# EAGLE design ArduinoSIDInterface (EAGLE 6.4)
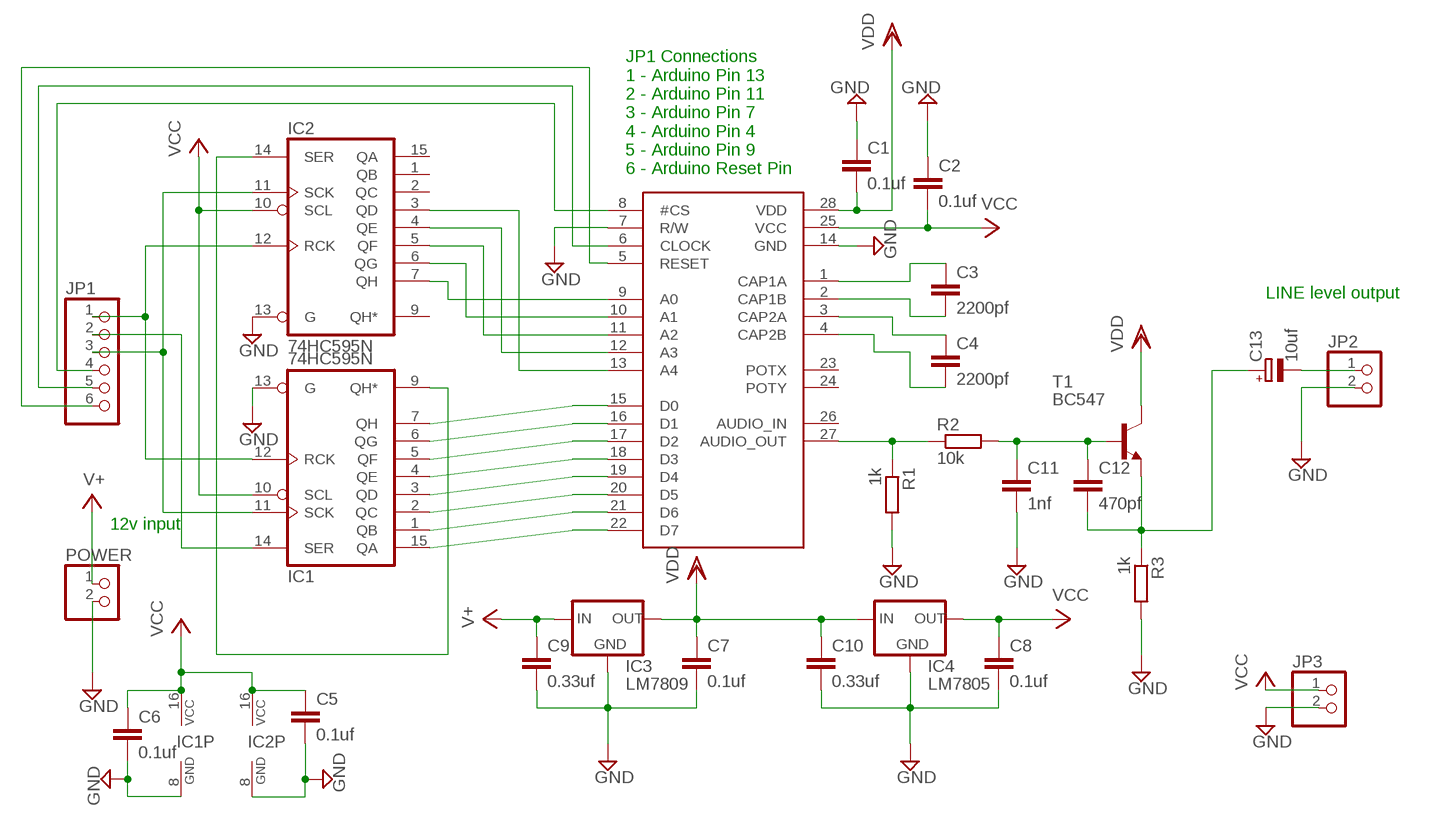
[diagram p0: schematic, sheet 1]

## Parts
C1  0.1uf  C-EU050-035X075  [C050-035X075]
C2  0.1uf  C-EU050-030X075  [C050-030X075]
C3  2200pf  C-EU075-042X103  [C075-042X103]
C4  2200pf  C-EU075-042X103  [C075-042X103]
C5  0.1uf  C-EU050-030X075  [C050-030X075]
C6  0.1uf  C-EU050-030X075  [C050-030X075]
C7  0.1uf  C10/4  [C10B4]
C8  0.1uf  C10/4  [C10B4]
C9  0.33uf  C15/5  [C15B5]
C10  0.33uf  C15/5  [C15B5]
C11  1nf  C-EU050-030X075  [C050-030X075]
C12  470pf  C-EU050-030X075  [C050-030X075]
C13  10uf  CPOL-EUE2-5  [E2-5]
IC1  74HC595N  [DIL16]
IC2  74HC595N  [DIL16]
IC3  LM7809  78XXS  [78XXS]
IC4  LM7805  78XXS  [78XXS]
JP1  PINHD-1X6  [1X06]
JP2  PINHD-1X2  [1X02]
JP3  PINHD-1X2  [1X02]
POWER  PINHD-1X2  [1X02]
R1  1k  R-EU_0204/7  [0204/7]
R2  10k  R-EU_0204/7  [0204/7]
R3  1k  R-EU_0204/7  [0204/7]
T1  BC547  [TO92]
U$1  6581  [DIL28-6]

## Nets
D0: IC1.7(QH) U$1.15(D0)
D1: IC1.6(QG) U$1.16(D1)
D2: IC1.5(QF) U$1.17(D2)
D3: IC1.4(QE) U$1.18(D3)
D4: IC1.3(QD) U$1.19(D4)
D5: IC1.2(QC) U$1.20(D5)
D6: IC1.1(QB) U$1.21(D6)
D7: IC1.15(QA) U$1.22(D7)
DATA: JP1.4 U$1.8(#CS)
GND: C1.1 C2.1 C5.2 C6.2 C7.2 C8.2 C9.2 C10.2 C11.2 IC1.8(GND) IC1.13(G) IC2.8(GND) IC2.13(G) IC3.GND IC4.GND JP2.2 JP3.2 POWER.2 R1.2 R3.2 U$1.7(R/W) U$1.14(GND)
N$1: IC1.9(QH*) IC2.14(SER)
N$2: C3.1 U$1.1(CAP1A)
N$3: IC2.7(QH) U$1.9(A0)
N$4: IC2.6(QG) U$1.10(A1)
N$5: IC2.5(QF) U$1.11(A2)
N$6: IC2.4(QE) U$1.12(A3)
N$7: IC2.3(QD) U$1.13(A4)
N$11: JP1.5 U$1.6(CLOCK)
N$12: JP1.6 U$1.5(RESET)
N$16: C3.2 U$1.2(CAP1B)
N$17: C4.1 U$1.3(CAP2A)
N$20: C4.2 U$1.4(CAP2B)
N$21: R1.1 R2.1 U$1.27(AUDIO_OUT)
N$22: C11.1 C12.1 R2.2 T1.2(B)
N$24: C12.2 C13.+ R3.1 T1.1(E)
N$26: C13.- JP2.1
RCK: IC1.12(RCK) IC2.12(RCK) JP1.1
SCK: IC1.11(SCK) IC2.11(SCK) JP1.3
SER: IC1.14(SER) JP1.2
V+: C9.1 IC3.IN POWER.1
VCC: C2.2 C5.1 C6.1 C8.1 IC1.10(SCL) IC1.16(VCC) IC2.10(SCL) IC2.16(VCC) IC4.OUT JP3.1 U$1.25(VCC)
VDD: C1.2 C7.1 C10.1 IC3.OUT IC4.IN T1.3(C) U$1.28(VDD)
Unconnected: IC2.1(QB) IC2.2(QC) IC2.9(QH*) IC2.15(QA) U$1.23(POTX) U$1.24(POTY) U$1.26(AUDIO_IN)

## Notes on the sheet
- JP1 Connections
  1 - Arduino Pin 13
  2 - Arduino Pin 11
  3 - Arduino Pin 7
  4 - Arduino Pin 4
  5 - Arduino Pin 9
  6 - Arduino Reset Pin
- LINE level output
- 12v input

## Library data of the parts
C1-C6 C11 C12 = rcl:C-EU: CAPACITOR, European symbol
C7-C10 = capacitor-wima:C: CAPACITOR naming: grid - package width
C13 = rcl:CPOL-EU: POLARIZED CAPACITOR, European symbol
IC1 IC2 = 74xx-eu:74*595: 8-bit SHIFT REGISTER, output latch
IC3 IC4 = v-reg:78XXS: VOLTAGE REGULATOR
JP1 = pinhead:PINHD-1X6: PIN HEADER
JP2 JP3 POWER = pinhead:PINHD-1X2: PIN HEADER
R1-R3 = resistor:R-EU_: RESISTOR, European symbol
T1 = transistor:BC547: NPN TRANSISTOR
U$1 = Mos6581_sid:6581: The Famous C64 Sound Chip - MOS6581

## Board
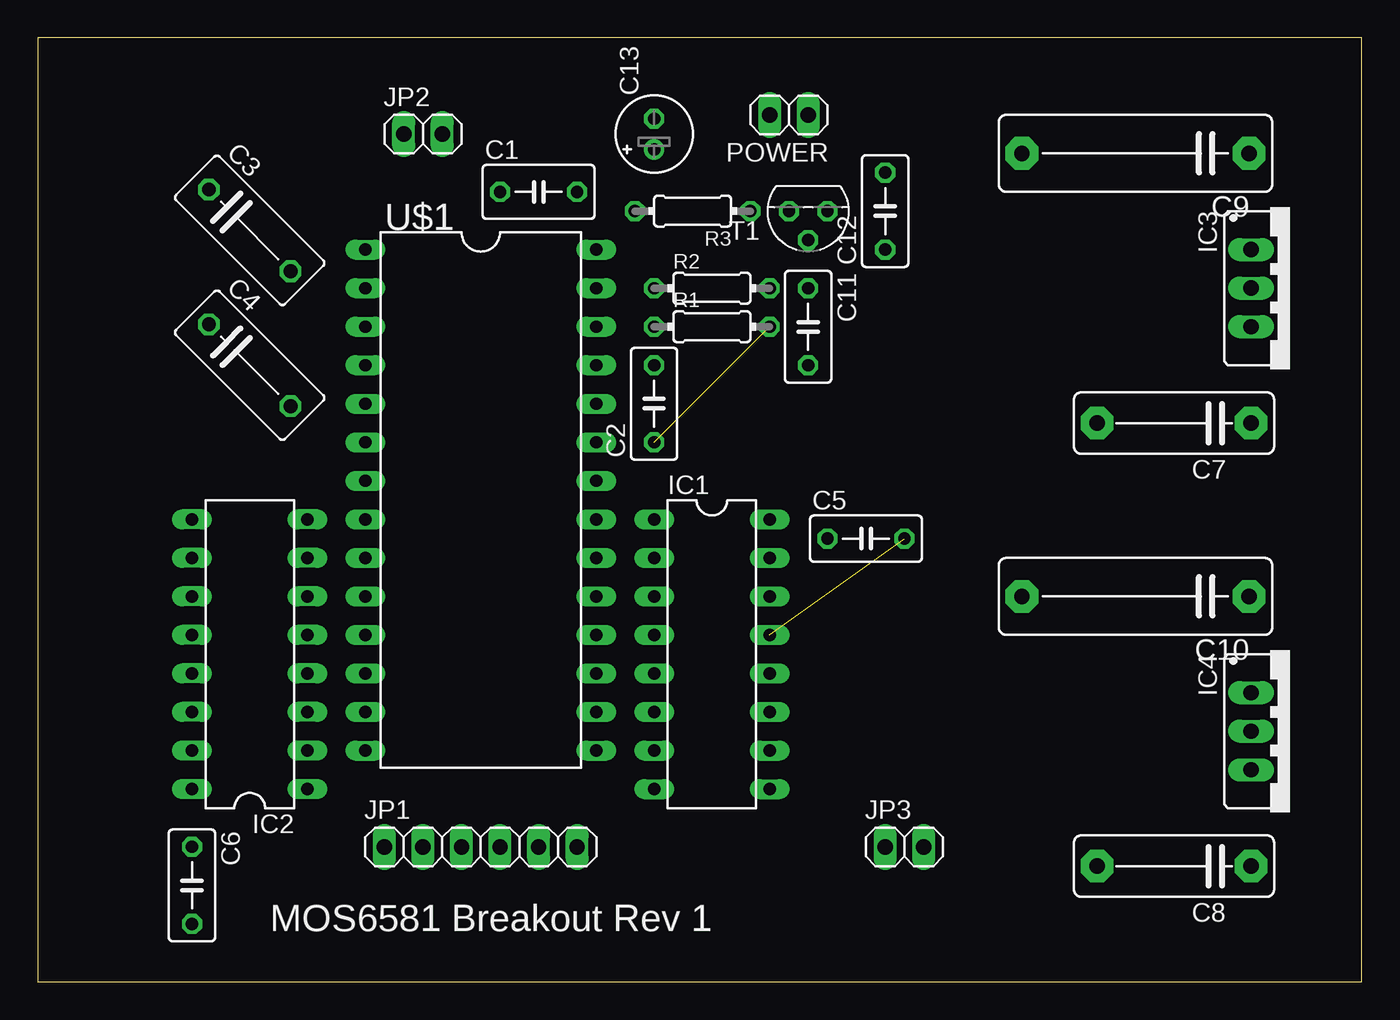
[diagram p1: board, top side]
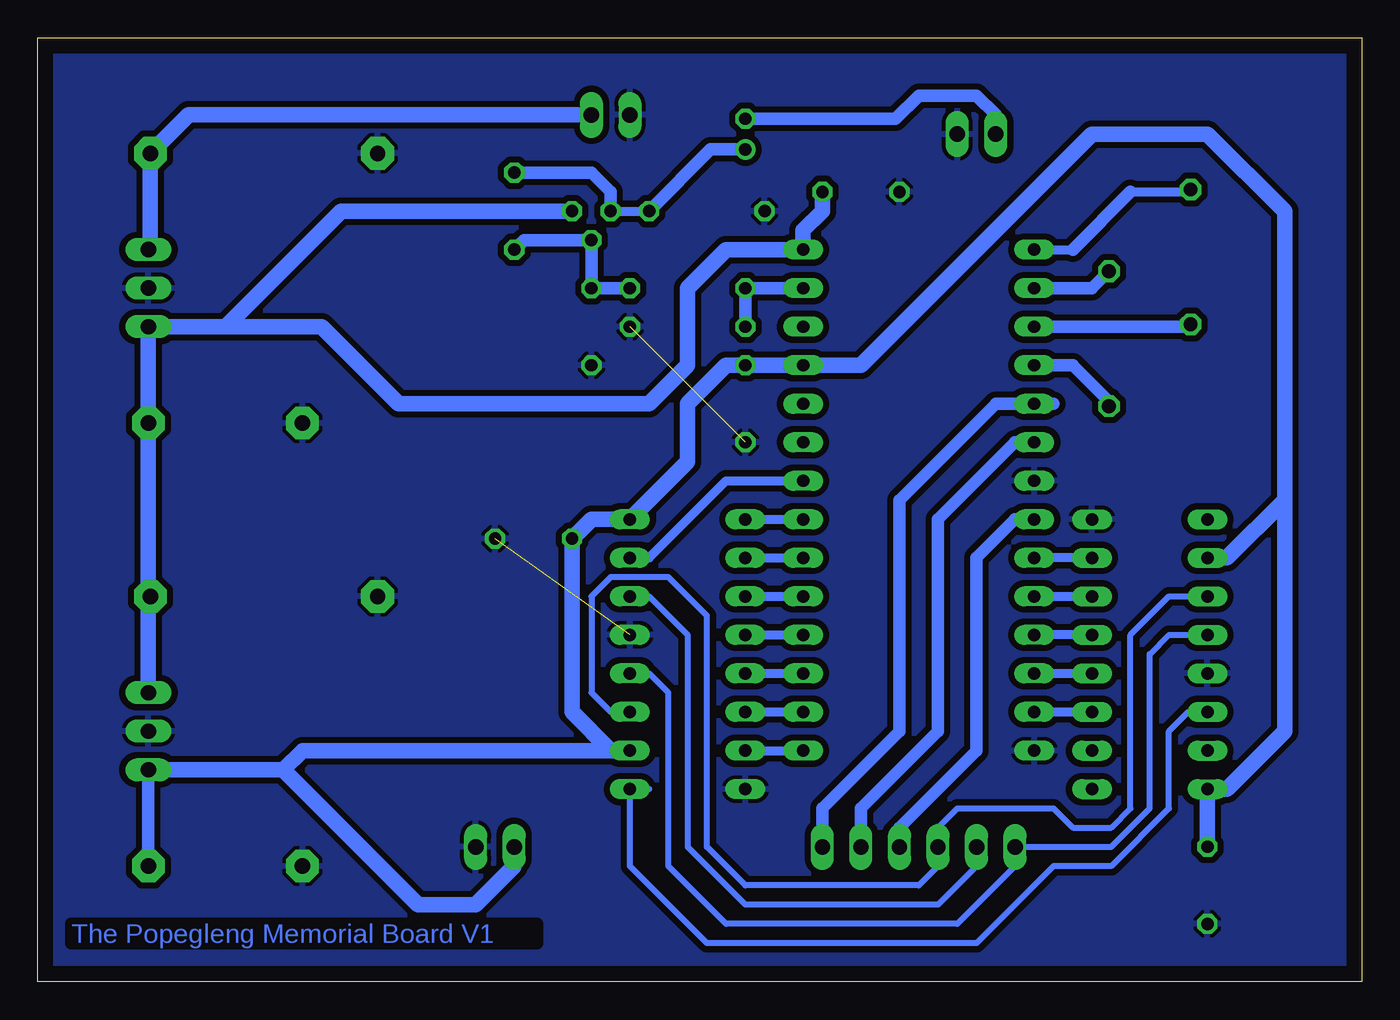
[diagram p2: board, bottom side, seen from below]

Size 87.3 x 62.22 mm. Coordinates in mm from the lower left corner, seen from the top.
Outline: 0,0 87.3,0 87.3,62.22 0,62.22 0,0
Copper layers (1*16): Top 0.035mm / dielectric 1.5mm / Bottom 0.035mm
Design rules "default": minimum track width 10mil, minimum drill 24mil, track to track 8mil, track to pad 8mil, pad to pad 8mil, via to via 8mil, smd to smd 8mil, copper to edge 40mil, drill to drill 8mil, minimum pad ring 10mil, minimum via ring 8mil, stop-mask expansion 4mil, vias tented up to drill 0mil, thermal gap 10mil

### Footprints (pad centres in the part's own frame; a part is rotated, then mirrored left to right if it is on the bottom)
C050-035X075 = drill 0.813 octagon: 1 -2.54,0; 2 2.54,0
C050-030X075 = drill 0.813 octagon: 1 -2.54,0; 2 2.54,0
C075-042X103 = drill 0.914 octagon: 1 -3.81,0; 2 3.81,0
C10B4 = drill 1.016 pad 2.159 octagon: 1 -5.08,0; 2 5.08,0
C15B5 = drill 1.016 pad 2.159 octagon: 1 -7.493,0; 2 7.493,0
E2-5 = drill 0.813 pad 1.27: + -1.016,0 | drill 0.813 pad 1.27 octagon: - 1.016,0
DIL16 = drill 0.813 long: 1 -8.89,-3.81; 2 -6.35,-3.81; 3 -3.81,-3.81; 4 -1.27,-3.81; 5 1.27,-3.81; 6 3.81,-3.81; 7 6.35,-3.81; 8 8.89,-3.81; 9 8.89,3.81; 10 6.35,3.81; 11 3.81,3.81; 12 1.27,3.81; 13 -1.27,3.81; 14 -3.81,3.81; 15 -6.35,3.81; 16 -8.89,3.81
78XXS = drill 1.016 long: GND 0,-2.54; IN -2.54,-2.54; OUT 2.54,-2.54
1X06 = drill 1.016 long: 1 -6.35,0; 2 -3.81,0; 3 -1.27,0; 4 1.27,0; 5 3.81,0; 6 6.35,0
1X02 = drill 1.016 long: 1 -1.27,0; 2 1.27,0
0204/7 = drill 0.813 octagon: 1 -3.81,0; 2 3.81,0
TO92 = drill 0.813 octagon: 1 1.27,0; 2 0,1.905; 3 -1.27,0
DIL28-6 = drill 0.813 long: 1 -16.51,-7.62; 2 -13.97,-7.62; 3 -11.43,-7.62; 4 -8.89,-7.62; 5 -6.35,-7.62; 6 -3.81,-7.62; 7 -1.27,-7.62; 8 1.27,-7.62; 9 3.81,-7.62; 10 6.35,-7.62; 11 8.89,-7.62; 12 11.43,-7.62; 13 13.97,-7.62; 14 16.51,-7.62; 15 16.51,7.62; 16 13.97,7.62; 17 11.43,7.62; 18 8.89,7.62; 19 6.35,7.62; 20 3.81,7.62; 21 1.27,7.62; 22 -1.27,7.62; 23 -3.81,7.62; 24 -6.35,7.62; 25 -8.89,7.62; 26 -11.43,7.62; 27 -13.97,7.62; 28 -16.51,7.62

### Placement (x,y rotation side)
C1  33.02,52.07 0 top
C2  40.64,38.1 90 top
C3  13.97,49.53 315 top
C4  13.97,40.64 315 top
C5  54.61,29.21 0 top
C6  10.16,6.35 270 top
C7  74.93,36.83 180 top
C8  74.93,7.62 180 top
C9  72.39,54.61 180 top
C10  72.39,25.4 180 top
C11  50.8,43.18 270 top
C12  55.88,50.8 90 top
C13  40.64,55.88 90 top
IC1  44.45,21.59 270 top
IC2  13.97,21.59 90 top
IC3  82.55,45.72 270 top
IC4  82.55,16.51 270 top
JP1  29.21,8.89 0 top
JP2  25.4,55.88 0 top
JP3  57.15,8.89 0 top
POWER  49.53,57.15 180 top
R1  44.45,43.18 0 top
R2  44.45,45.72 0 top
R3  43.18,50.8 180 top
T1  50.8,50.8 180 top
U$1  29.21,31.75 270 top

### Tracks (layer width: path | path; a pad name or v marks a point on that pad's centre or on a via)
D0
  Bottom 0.61: IC1.7 U$1.15
D1
  Bottom 0.61: IC1.6 U$1.16
D2
  Bottom 0.61: IC1.5 U$1.17
D3
  Bottom 0.61: IC1.4 U$1.18
D4
  Bottom 0.61: IC1.3 U$1.19
D5
  Bottom 0.61: IC1.2 U$1.20
D6
  Bottom 0.61: IC1.1 U$1.21
D7
  Bottom 0.61: IC1.15 46.99,27.94 41.91,33.02 U$1.22
DATA
  Bottom 0.406: JP1.4 30.48,10.16 | 22.86,30.48 U$1.8
  Bottom 0.813: 30.48,10.16 25.4,15.24 25.4,27.94 22.86,30.48
GND  (2 unrouted)
  pour Bottom (isolate 0.406): -1.27,62.23 90.17,63.5 90.17,0 -1.27,-1.27
N$1
  Bottom 0.406: IC2.14 11.43,17.78 12.7,16.51 12.7,11.43 16.51,7.62 20.32,7.62 25.4,2.54 43.18,2.54 48.26,7.62 IC1.9 46.99,12.7
N$2
  Bottom 0.61: U$1.1 19.05,48.26 | 15.24,52.07 11.43,52.07 C3.1
  Bottom 0.813: 19.05,48.26 15.24,52.07
N$3
  Bottom 0.61: IC2.7 U$1.9
N$4
  Bottom 0.61: U$1.10 IC2.6
N$5
  Bottom 0.61: IC2.5 U$1.11
N$6
  Bottom 0.61: U$1.12 IC2.4
N$7
  Bottom 0.61: U$1.13 IC2.3
N$11
  Bottom 0.813: JP1.5 33.02,11.43 27.94,16.51 27.94,30.48 22.86,35.56 U$1.6
N$12
  Bottom 0.813: JP1.6 35.56,11.43 30.48,16.51 30.48,31.75 24.13,38.1 U$1.5 20.32,38.1
N$16
  Bottom 0.813: U$1.2 17.78,45.72 C3.2
N$17
  Bottom 0.61: 11.43,43.18 C4.1
  Bottom 0.813: U$1.3 11.43,43.18
N$20
  Bottom 0.61: 16.51,38.1 | 16.51,38.1 C4.2
  Bottom 0.813: U$1.4 19.05,40.64 16.51,38.1
N$21
  Bottom 0.813: U$1.27 R2.1 R1.1
N$22
  Bottom 0.813: R2.2 C11.1 T1.2 55.24,48.9 C12.1
N$24
  Bottom 0.61: T1.1 R3.1
  Bottom 0.813: C13.+ 42.93,54.86 R3.1 | C12.2 50.8,53.34 49.53,52.07 T1.1
N$26
  Bottom 0.813: C13.- 30.73,56.9 29.21,58.42 25.4,58.42 24.13,57.15 JP2.1
RCK
  Bottom 0.406: IC2.12 12.7,22.86 13.97,21.59 13.97,11.43 16.51,8.89 JP1.1 22.86,7.62 26.67,3.81 41.91,3.81 45.72,7.62 45.72,19.05 46.99,20.32 IC1.12
SCK
  Bottom 0.406: IC1.11 49.53,17.78 50.8,19.05 50.8,25.4 49.53,26.67 45.72,26.67 43.18,24.13 43.18,8.89 40.64,6.35 29.21,6.35 27.94,7.62 JP1.3 27.94,10.16 26.67,11.43 20.32,11.43 19.05,10.16 16.51,10.16 15.24,11.43 15.24,22.86 12.7,25.4 IC2.11
SER
  Bottom 0.406: IC1.14 46.99,25.4 44.45,22.86 44.45,8.89 40.64,5.08 27.94,5.08 25.4,7.62 JP1.2
V+
  Bottom 1.016: IC3.IN 79.88,48.39 C9.1 77.34,57.15 POWER.1
VCC
  Bottom 0.813: C8.1 IC4.OUT
  Bottom 1.016: 5.08,31.75 5.08,50.8 10.16,55.88 17.78,55.88 33.02,40.64 U$1.25 C2.2 41.91,40.64 44.45,38.1 44.45,34.29 IC1.16 50.8,30.48 C5.1 52.07,17.78 49.53,15.24 | 5.08,31.75 5.08,16.51 8.89,12.7 IC2.16 C6.1 | IC2.10 8.89,27.94 5.08,31.75 | 49.53,15.24 IC1.10 | IC4.OUT 71.12,13.97 | 71.12,13.97 62.23,5.08 58.42,5.08 55.88,7.62 JP3.1 | 49.53,15.24 69.85,15.24 71.12,13.97
VDD
  Bottom 1.016: 55.88,50.8 T1.3 67.31,50.8 74.93,43.18 IC3.OUT | C1.2 35.56,50.8 36.83,49.53 U$1.28 41.91,48.26 44.45,45.72 44.45,40.64 46.99,38.1 63.5,38.1 68.58,43.18 IC3.OUT | IC4.IN 80.01,25.27 C10.1 80.01,25.53 C7.1 IC3.OUT

### Text on the board
Bottom: The Popegleng Memorial Board V1
tNames: MOS6581 Breakout Rev 1